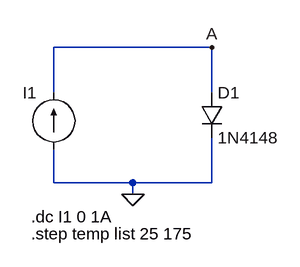
[diagram p0: schematic D-VA-F2.asc]
D-VA-F2.asc, the LTspice schematic file:
Version 4
SHEET 1 880 680
WIRE 160 160 -64 160
WIRE -64 224 -64 160
WIRE 160 224 160 160
WIRE -64 352 -64 304
WIRE 48 352 -64 352
WIRE 160 352 160 288
WIRE 160 352 48 352
WIRE 48 368 48 352
FLAG 48 368 0
FLAG 160 160 A
SYMBOL diode 144 224 R0
SYMATTR InstName D1
SYMATTR Value 1N4148
SYMBOL current -64 304 R180
WINDOW 0 24 80 Left 2
WINDOW 3 24 0 Invisible 2
WINDOW 123 0 0 Left 2
WINDOW 39 0 0 Left 2
SYMATTR InstName I1
SYMATTR Value 0
TEXT -96 400 Left 2 !.dc I1 0 1A
TEXT -96 424 Left 2 !.step temp list 25 175

The netlist it stands for:
* D-VA-F2.asc
D1 A 0 1N4148
I1 0 A 0
.model D D
.lib standard.dio
.dc I1 0 1A
.step temp list 25 175
.backanno
.end